# EAGLE schematic EIB A79024-001 (EAGLE 9.3.2)
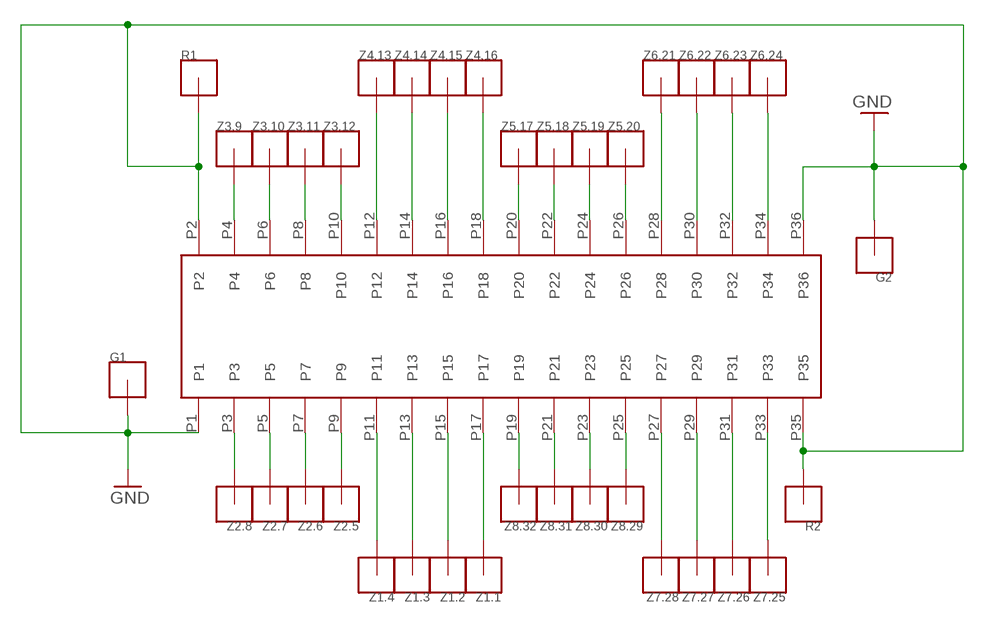
[diagram p0: schematic, sheet 1]

## Parts
A79024  OMNETICS  [A79024]
G1  S_P_HOLE  [S_P_HOLE]
G2  S_P_HOLE  [S_P_HOLE]
R1  S_P_HOLE  [S_P_HOLE]
R2  S_P_HOLE  [S_P_HOLE]
Z1.1  S_P_HOLE  [S_P_HOLE]
Z1.2  S_P_HOLE  [S_P_HOLE]
Z1.3  S_P_HOLE  [S_P_HOLE]
Z1.4  S_P_HOLE  [S_P_HOLE]
Z2.5  S_P_HOLE  [S_P_HOLE]
Z2.6  S_P_HOLE  [S_P_HOLE]
Z2.7  S_P_HOLE  [S_P_HOLE]
Z2.8  S_P_HOLE  [S_P_HOLE]
Z3.9  S_P_HOLE  [S_P_HOLE]
Z3.10  S_P_HOLE  [S_P_HOLE]
Z3.11  S_P_HOLE  [S_P_HOLE]
Z3.12  S_P_HOLE  [S_P_HOLE]
Z4.13  S_P_HOLE  [S_P_HOLE]
Z4.14  S_P_HOLE  [S_P_HOLE]
Z4.15  S_P_HOLE  [S_P_HOLE]
Z4.16  S_P_HOLE  [S_P_HOLE]
Z5.17  S_P_HOLE  [S_P_HOLE]
Z5.18  S_P_HOLE  [S_P_HOLE]
Z5.19  S_P_HOLE  [S_P_HOLE]
Z5.20  S_P_HOLE  [S_P_HOLE]
Z6.21  S_P_HOLE  [S_P_HOLE]
Z6.22  S_P_HOLE  [S_P_HOLE]
Z6.23  S_P_HOLE  [S_P_HOLE]
Z6.24  S_P_HOLE  [S_P_HOLE]
Z7.25  S_P_HOLE  [S_P_HOLE]
Z7.26  S_P_HOLE  [S_P_HOLE]
Z7.27  S_P_HOLE  [S_P_HOLE]
Z7.28  S_P_HOLE  [S_P_HOLE]
Z8.29  S_P_HOLE  [S_P_HOLE]
Z8.30  S_P_HOLE  [S_P_HOLE]
Z8.31  S_P_HOLE  [S_P_HOLE]
Z8.32  S_P_HOLE  [S_P_HOLE]

## Nets
GND: A79024.P1 A79024.P2 A79024.P35 A79024.P36 G1.P1 G2.P1 R1.P1 R2.P1
N$1: A79024.P28 Z6.21.P1
N$2: A79024.P32 Z6.23.P1
N$3: A79024.P34 Z6.24.P1
N$4: A79024.P30 Z6.22.P1
N$5: A79024.P4 Z3.9.P1
N$6: A79024.P6 Z3.10.P1
N$7: A79024.P8 Z3.11.P1
N$8: A79024.P10 Z3.12.P1
N$9: A79024.P12 Z4.13.P1
N$10: A79024.P14 Z4.14.P1
N$11: A79024.P16 Z4.15.P1
N$12: A79024.P18 Z4.16.P1
N$13: A79024.P20 Z5.17.P1
N$14: A79024.P22 Z5.18.P1
N$15: A79024.P24 Z5.19.P1
N$16: A79024.P26 Z5.20.P1
N$19: A79024.P3 Z2.8.P1
N$20: A79024.P5 Z2.7.P1
N$21: A79024.P7 Z2.6.P1
N$22: A79024.P9 Z2.5.P1
N$23: A79024.P11 Z1.4.P1
N$24: A79024.P13 Z1.3.P1
N$25: A79024.P15 Z1.2.P1
N$26: A79024.P17 Z1.1.P1
N$27: A79024.P19 Z8.32.P1
N$28: A79024.P21 Z8.31.P1
N$29: A79024.P23 Z8.30.P1
N$30: A79024.P25 Z8.29.P1
N$31: A79024.P27 Z7.28.P1
N$32: A79024.P29 Z7.27.P1
N$33: A79024.P31 Z7.26.P1
N$63: A79024.P33 Z7.25.P1

## Library data of the parts
A79024 = omnetics:OMNETICS
G1 G2 R1 R2 Z1.1-Z1.4 Z2.5-Z2.8 Z3.9-Z3.12 Z4.13-Z4.16 Z5.17-Z5.20 Z6.21-Z6.24 Z7.25-Z7.28 Z8.29-Z8.32 = omnetics:S_P_HOLE